# Altium schematic sheet 09_Misc.SchDoc: Misc (part 1 of 2)
size A3; Organization: Lime Microsystems; Address1: Surrey Tech Centre; Address2: Guildford GU2 7YG; Address3: Surrey; Address4: United Kingdom; SheetNumber: 10
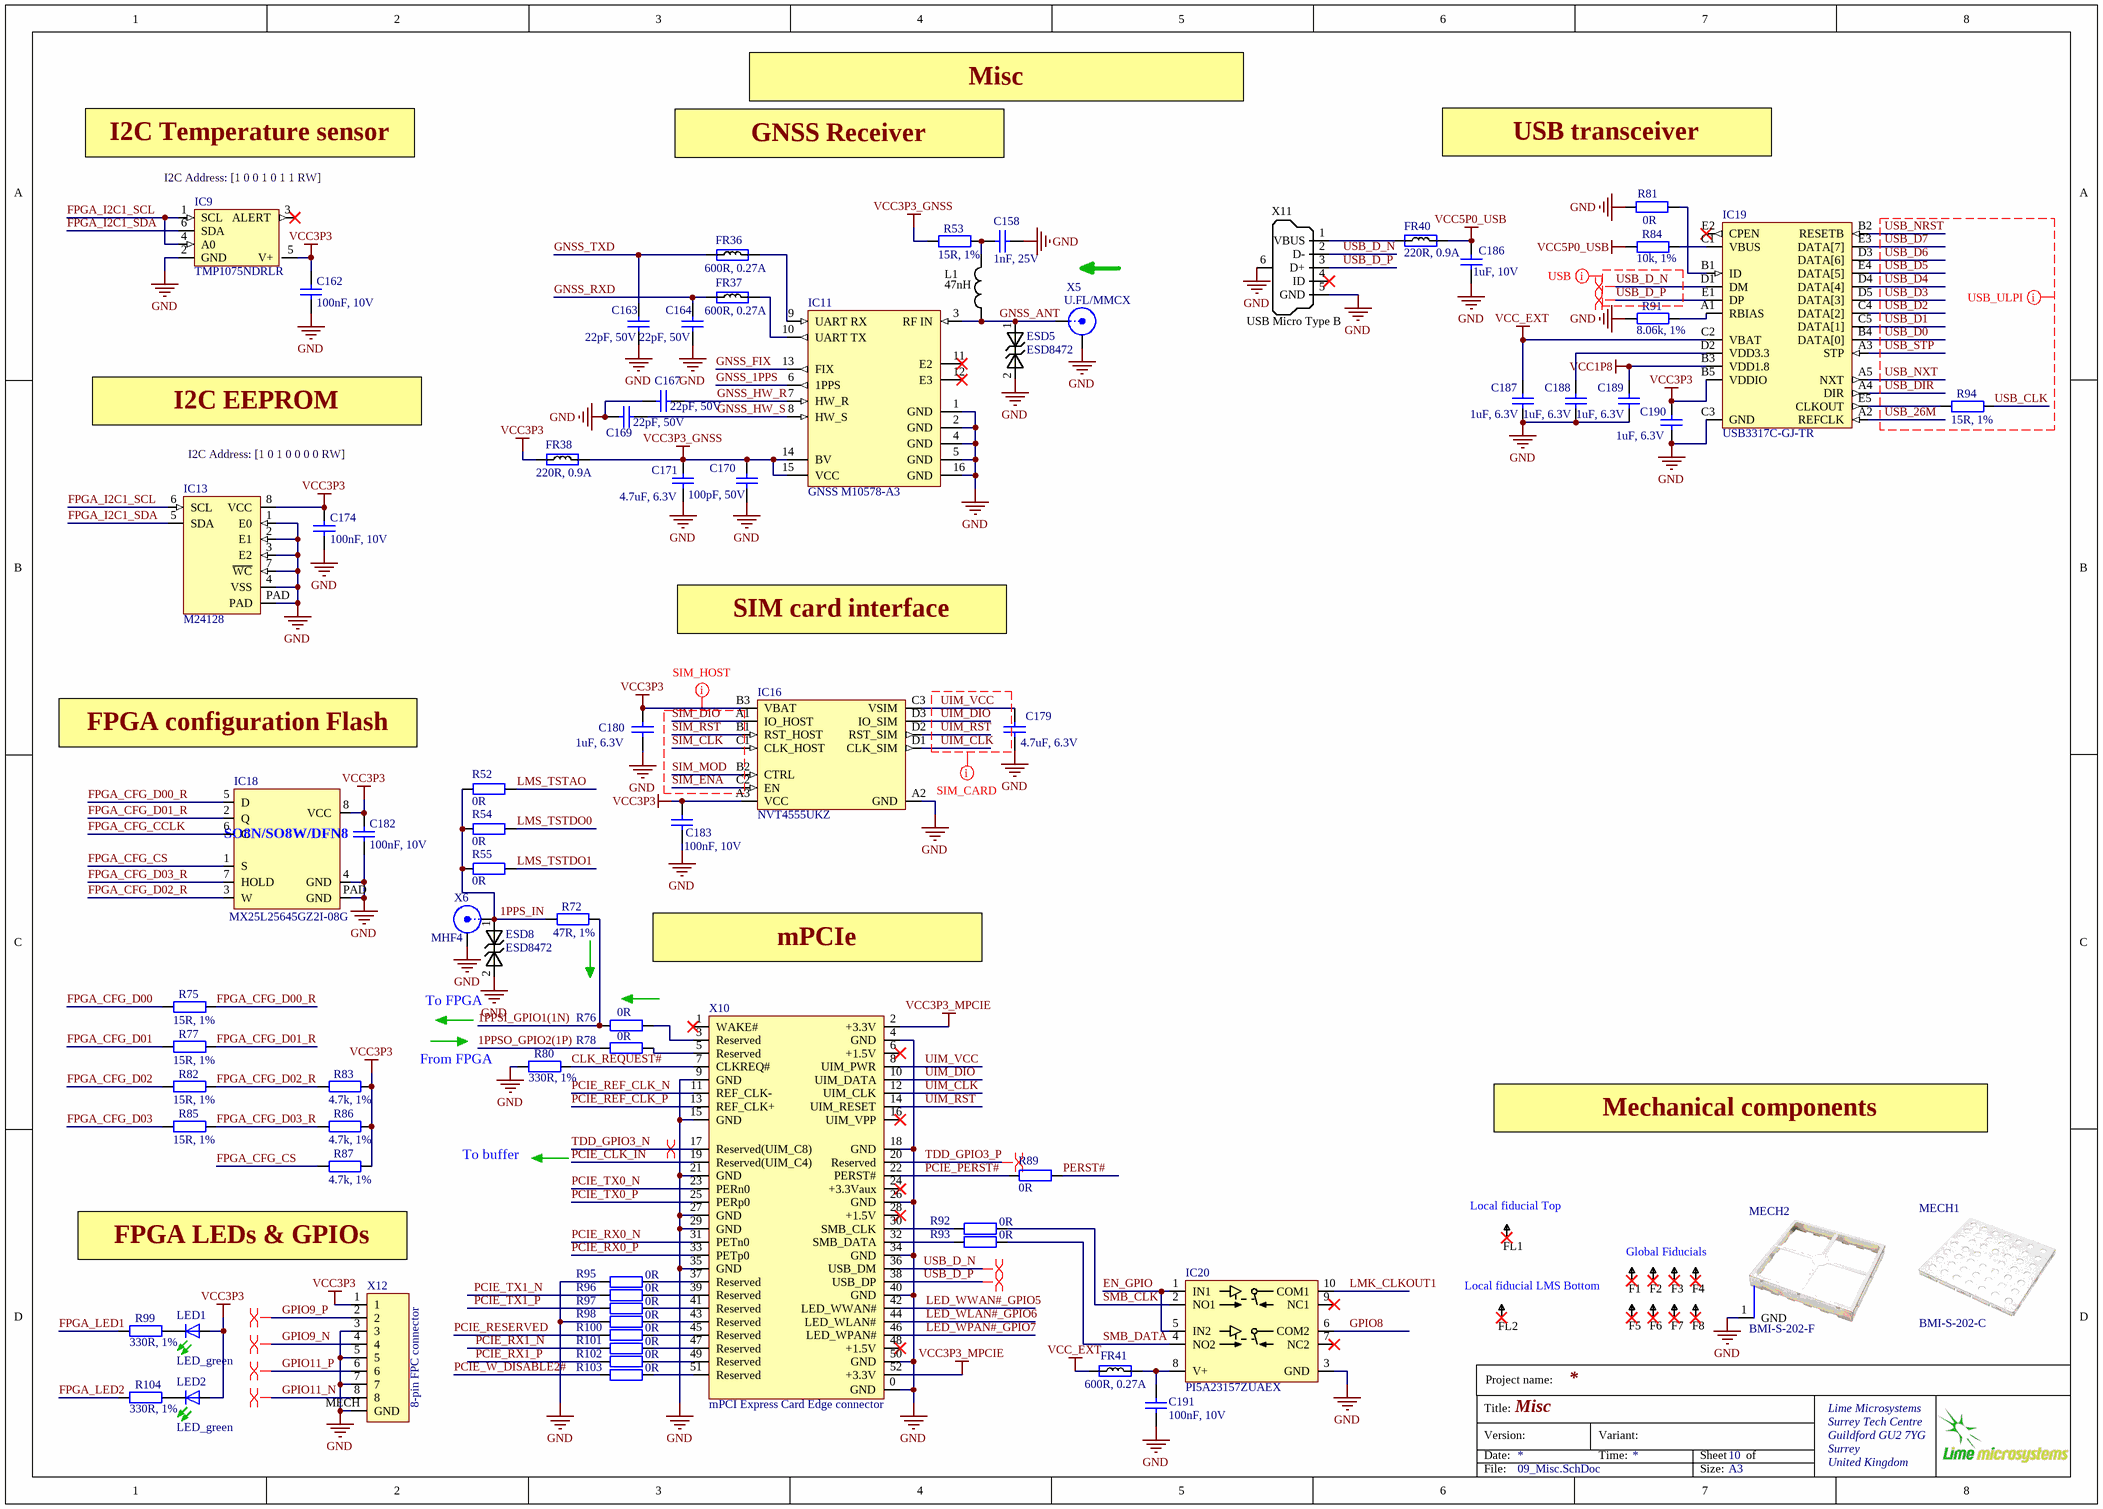
[diagram p0: 09_Misc.SchDoc]

## Parts
C158  1nF, 25V  [CAP0201]
C162  100nF, 10V  [CAP0201]
C163  22pF, 50V  [CAP0201]
C164  22pF, 50V  [CAP0201]
C167  22pF, 50V  [CAP0201]
C169  22pF, 50V  [CAP0201]
C170  100pF, 50V  [CAP0201]
C171  4.7uF, 6.3V  [CAP0402]
C174  100nF, 10V  [CAP0201]
C179  4.7uF, 6.3V  [CAP0402]
C180  1uF, 6.3V  [CAP0201]
C182  100nF, 10V  [CAP0201]
C183  100nF, 10V  [CAP0201]
C186  1uF, 10V  [CAP0402]
C187  1uF, 6.3V  [CAP0201]
C188  1uF, 6.3V  [CAP0201]
C189  1uF, 6.3V  [CAP0201]
C190  1uF, 6.3V  [CAP0201]
C191  100nF, 10V  [CAP0201]
ESD5  ESD8472  [ESD8472_X3DFN2]
ESD8  ESD8472  [ESD8472_X3DFN2]
F1  Fiducial  [Fiducial]  (value not drawn)
F2  Fiducial  [Fiducial]  (value not drawn)
F3  Fiducial  [Fiducial]  (value not drawn)
F4  Fiducial  [Fiducial]  (value not drawn)
F5  Fiducial  [Fiducial]  (value not drawn)
F6  Fiducial  [Fiducial]  (value not drawn)
F7  Fiducial  [Fiducial]  (value not drawn)
F8  Fiducial  [Fiducial]  (value not drawn)
FL1  Fiducial  [Fiducial_local]  (value not drawn)
FL2  Fiducial  [Fiducial_local]  (value not drawn)
FR36  600R, 0.27A  [RES0201]
FR37  600R, 0.27A  [RES0201]
FR38  220R, 0.9A  [RES0402]
FR40  220R, 0.9A  [RES0402]
FR41  600R, 0.27A  [RES0201]
IC9  TMP1075NDRLR  [TMP1075NDRLR_temperature_sensor_SOT563]
IC11  GNSS M10578-A3  [M10578-A3_v2]
IC13  M24128  [M24128-DFMC6TG]
IC16  NVT4555UKZ  [NVT4555UKZ_SIM_INTERFACE_WLCSP12]
IC18  MX25L25645GZ2I-08G  [S25FL164K_WSON8_DFN6]
IC19  USB3317C-GJ-TR  [USB3317C-GJ-TR_USB2_transceiver]
IC20  PI5A23157ZUAEX  [PI5A23157ZUAEX_SPDT_SW_10UQFN]
L1  47nH  [RES0402]
LED1  LED_green  [LED0201]
LED2  LED_green  [LED0201]
MECH1  BMI-S-202-C  [BMI-S-202-C_RF_SHIELD_COVER]
MECH2  BMI-S-202-F  [BMI-S-202-F_RF_SHIELD_FRAME_v3]
R52  0R  [RES0201]
R53  15R, 1%  [RES0201]
R54  0R  [RES0201]
R55  0R  [RES0201]
R72  47R, 1%  [RES0201]
R75  15R, 1%  [RES0201]
R76  0R  [RES0201]
R77  15R, 1%  [RES0201]
R78  0R  [RES0201]
R80  330R, 1%  [RES0201]
R81  0R  [RES0201]
R82  15R, 1%  [RES0201]
R83  4.7k, 1%  [RES0201]
R84  10k, 1%  [RES0201]
R85  15R, 1%  [RES0201]
R86  4.7k, 1%  [RES0201]
R87  4.7k, 1%  [RES0201]
R89  0R  [RES0201]
R91  8.06k, 1%  [RES0201]
R92  0R  [RES0201]
R93  0R  [RES0201]
R94  15R, 1%  [RES0201]
R95  0R  [RES0201]
R96  0R  [RES0201]
R97  0R  [RES0201]
R98  0R  [RES0201]
R99  330R, 1%  [RES0201]
R100  0R  [RES0201]
R101  0R  [RES0201]
R102  0R  [RES0201]
R103  0R  [RES0201]
R104  330R, 1%  [RES0201]
X5  U.FL/MMCX  [MMCX_UFL_conn_u_v2]
X6  MHF4  [IPEX_MHF4_conn]
X10  mPCI Express Card Edge connector  [PCIe_MiniCard]  (no BOM)
X11  USB Micro Type B  [USB_Micro_TypeB_47346-0001]
X12  8-pin FPC connector  [503480-0800_8PIN_FPC_CONN]

## Nets
GND: C158.2 C162.2 C163.2 C164.2 C167.2 C169.2 C170.1 C171.1 C174.2 C179.1 C180.2 C182.2 C183.2 C186.1 C187.2 C188.2 C189.2 C190.2 C191.2 ESD5.2 ESD8.2 IC9.2(GND) IC11.1(GND) IC11.2(GND) IC11.4(GND) IC11.5(GND) IC11.16(GND) IC13.1(E0) IC13.2(E1) IC13.3(E2) IC13.4(VSS) IC13.7(~{WC}) IC13.PAD IC16.A2(GND) IC18.4(GND) IC18.PAD(GND) IC19.C3(GND) IC20.3(GND) MECH2.1(GND) R80.2 R81.1 R91.2 R95.1 R98.1 X5.2(Y) X6.2(Y) X10.0(GND) X10.4(GND) X10.9(GND) X10.15(GND) X10.18(GND) X10.21(GND) X10.26(GND) X10.27(GND) X10.29(GND) X10.34(GND) X10.35(GND) X10.40(GND) X10.50(GND) X11.5(GND) X11.6(Shell) X12.3 X12.5 X12.7 X12.MECH(GND)
VCC1P8: C189.1 IC19.B3(VDD1.8)
VCC3P3: C162.1 C174.1 C180.1 C182.1 C183.1 C190.1 FR38.1 IC9.5(V+) IC13.8(VCC) IC16.A3(VCC) IC16.B3(VBAT) IC18.8(VCC) IC19.B5(VDDIO) LED1.A LED2.A R83.1 R86.1 R87.1 X12.1
VCC3P3_GNSS: C170.2 C171.2 FR38.2 IC11.14(BV) IC11.15(VCC) R53.2
VCC3P3_MPCIE: X10.2(+3.3V) X10.52(+3.3V)
VCC5P0_USB: C186.2 FR40.2 R84.2
VCC_EXT: C187.1 FR41.1 IC19.C2(VBAT)
1PPS_IN: ESD8.1 R52.1 R54.1 R55.1 R72.2 X6.1(X)
1PPSI_GPIO1(1N): R72.1 R76.1
1PPSO_GPIO2(1P): R78.1
CLK_REQUEST#: R80.1 X10.7(CLKREQ#)
EN_GPIO: IC20.1(IN1) IC20.5(IN2)
FPGA_CFG_CCLK: IC18.6(C)
FPGA_CFG_CS: IC18.1(S) R87.2
FPGA_CFG_D00: R75.2
FPGA_CFG_D00_R: IC18.5(D) R75.1
FPGA_CFG_D01: R77.2
FPGA_CFG_D01_R: IC18.2(Q) R77.1
FPGA_CFG_D02: R82.2
FPGA_CFG_D02_R: IC18.3(W) R82.1 R83.2
FPGA_CFG_D03: R85.2
FPGA_CFG_D03_R: IC18.7(HOLD) R85.1 R86.2
FPGA_I2C1_SCL: IC9.1(SCL) IC9.4(A0) IC13.6(SCL)
FPGA_I2C1_SDA: IC9.6(SDA) IC13.5(SDA)
FPGA_LED1: R99.2
FPGA_LED2: R104.2
GNSS_1PPS: IC11.6(1PPS)
GNSS_ANT: ESD5.1 IC11.3(RF_IN) L1.1 X5.1(X)
GNSS_FIX: IC11.13(FIX)
GNSS_HW_R: C167.1 IC11.7(HW_R)
GNSS_HW_S: C169.1 IC11.8(HW_S)
GNSS_RXD: C164.1 FR37.1
GNSS_TXD: C163.1 FR36.1
GPIO8: IC20.6(COM2)
GPIO9_N: X12.4
GPIO9_P: X12.2
GPIO11_N: X12.8
GPIO11_P: X12.6
LED_WLAN#_GPIO6: X10.44(LED_WLAN#)
LED_WPAN#_GPIO7: X10.46(LED_WPAN#)
LED_WWAN#_GPIO5: X10.42(LED_WWAN#)
LMK_CLKOUT1: IC20.10(COM1)
LMS_TSTAO: R52.2
LMS_TSTDO0: R54.2
LMS_TSTDO1: R55.2
PCIE_CLK_IN: X10.19(Reserved(UIM_C4))
PCIE_PERST#: R89.1 X10.22(PERST#)
PCIE_REF_CLK_N: X10.11(REF_CLK-)
PCIE_REF_CLK_P: X10.13(REF_CLK+)
PCIE_RESERVED: R100.1
PCIE_RX0_N: X10.31(PETn0)
PCIE_RX0_P: X10.33(PETp0)
PCIE_RX1_N: R101.1
PCIE_RX1_P: R102.1
PCIE_TX0_N: X10.23(PERn0)
PCIE_TX0_P: X10.25(PERp0)
PCIE_TX1_N: R96.1
PCIE_TX1_P: R97.1
PCIE_W_DISABLE2#: R103.1
PERST#: R89.2
SIM_CLK: IC16.C1(CLK_HOST)
SIM_DIO: IC16.A1(IO_HOST)
SIM_ENA: IC16.C2(EN)
SIM_MOD: IC16.B2(CTRL)
SIM_RST: IC16.B1(RST_HOST)
SMB_CLK: IC20.2(NO1) R92.2
SMB_DATA: IC20.4(NO2) R93.2
TDD_GPIO3_N: X10.17(Reserved(UIM_C8))
TDD_GPIO3_P: X10.20(Reserved)
UIM_CLK: IC16.D1(CLK_SIM) X10.12(UIM_CLK)
UIM_DIO: IC16.D3(IO_SIM) X10.10(UIM_DATA)
UIM_RST: IC16.D2(RST_SIM) X10.14(UIM_RESET)
UIM_VCC: C179.2 IC16.C3(VSIM) X10.8(UIM_PWR)
USB_26M: IC19.A2(REFCLK)
USB_CLK: R94.1
USB_D0: IC19.B4(DATA[0])
USB_D1: IC19.C5(DATA[1])
USB_D2: IC19.C4(DATA[2])
USB_D3: IC19.D5(DATA[3])
USB_D4: IC19.D4(DATA[4])
USB_D5: IC19.E4(DATA[5])
USB_D6: IC19.D3(DATA[6])
USB_D7: IC19.E3(DATA[7])
USB_D_N: IC19.D1(DM) X10.36(USB_DM) X11.2(D-)
USB_D_P: IC19.E1(DP) X10.38(USB_DP) X11.3(D+)
USB_DIR: IC19.A4(DIR)
USB_NRST: IC19.B2(RESETB)
USB_NXT: IC19.A5(NXT)
USB_STP: IC19.A3(STP)
NetC158_1: C158.1 L1.2 R53.1
NetC188_1: C188.1 IC19.D2(VDD3.3)
NetC191_1: C191.1 FR41.2 IC20.8(V+)
NetFR36_2: FR36.2 IC11.9(UART_RX)
NetFR37_2: FR37.2 IC11.10(UART_TX)
NetFR40_1: FR40.1 X11.1(VBUS)
NetIC19_A1: IC19.A1(RBIAS) R91.1
NetIC19_B1: IC19.B1(ID) R81.2
NetIC19_C1: IC19.C1(VBUS) R84.1
NetIC19_E5: IC19.E5(CLKOUT) R94.2
NetLED1_K: LED1.K(C) R99.1
NetLED2_K: LED2.K(C) R104.1
NetR76_2: R76.2 X10.3(Reserved)
NetR78_2: R78.2 X10.5(Reserved)
NetR92_1: R92.1 X10.30(SMB_CLK)
NetR93_1: R93.1 X10.32(SMB_DATA)
NetR95_2: R95.2 X10.37(Reserved)
NetR96_2: R96.2 X10.39(Reserved)
NetR97_2: R97.2 X10.41(Reserved)
NetR98_2: R98.2 X10.43(Reserved)
NetR100_2: R100.2 X10.45(Reserved)
NetR101_2: R101.2 X10.47(Reserved)
NetR102_2: R102.2 X10.49(Reserved)
NetR103_2: R103.2 X10.51(Reserved)

Not connected (* = marked no-connect by the designer): F1 1*; F2 1*; F3 1*; F4 1*; F5 1*; F6 1*; F7 1*; F8 1*; FL1 1*; FL2 1*; IC9 3(ALERT)*; IC11 11(E2)* 12(E3)*; IC19 E2(CPEN)*; IC20 7(NC2)* 9(NC1)*; X10 1(WAKE#)* 6(+1.5V)* 16(UIM_VPP)* 24(+3.3Vaux)* 28(+1.5V)* 48(+1.5V)*; X11 4(ID)*

## Layout directives
net class SIM_HOST: SIM_CLK, SIM_DIO, SIM_ENA, SIM_MOD, SIM_RST
net class SIM_CARD: UIM_CLK, UIM_DIO, UIM_RST, UIM_VCC
differential pair: GPIO9_N, GPIO9_P, GPIO11_N, GPIO11_P, TDD_GPIO3_N, TDD_GPIO3_P, USB_D_N, USB_D_P
net class USB: USB_D_N, USB_D_P
net class USB_ULPI: USB_26M, USB_CLK, USB_D0, USB_D1, USB_D2, USB_D3, USB_D4, USB_D5, USB_D6, USB_D7, USB_DIR, USB_NRST, USB_NXT, USB_STP

## Notes on the sheet
- Misc
- I2C Temperature sensor
- (near IC9) I2C Address: [1 0 0 1 0 1 1 RW]
- GNSS Receiver
- USB transceiver
- I2C EEPROM
- I2C Address: [1 0 1 0 0 0 0 RW]
- SIM card interface
- FPGA configuration Flash
- mPCIe
- (near ESD8) To FPGA
- From FPGA
- Mechanical components
- To buffer
- FPGA LEDs & GPIOs
- (near FL1) Local fiducial Top
- Global Fiducials
- Local fiducial LMS Bottom
- Project name:
- Title:
- Version:
- Date:
- Variant:
- Time:
- Sheet
- of
- File:
- Size:
- A3
- (in symbol M25P40_with_pad) SO8N/SO8W/DFN8